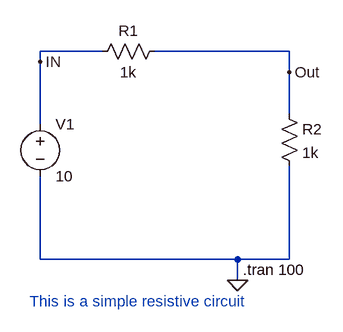
[diagram p0: schematic voltage-divider.asc]
voltage-divider.asc, the LTspice schematic file:
Version 4
SHEET 1 880 680
WIRE 256 240 160 240
WIRE 544 240 336 240
WIRE 160 256 160 240
WIRE 544 272 544 240
WIRE 544 336 544 272
WIRE 160 352 160 256
WIRE 160 560 160 432
WIRE 464 560 160 560
WIRE 544 560 544 416
WIRE 544 560 464 560
WIRE 464 592 464 560
FLAG 464 592 0
FLAG 544 272 Out
FLAG 160 256 IN
SYMBOL res 352 224 R90
WINDOW 0 0 56 VBottom 2
WINDOW 3 32 56 VTop 2
SYMATTR InstName R1
SYMATTR Value 1k
SYMBOL res 528 320 R0
SYMATTR InstName R2
SYMATTR Value 1k
SYMBOL voltage 160 336 R0
SYMATTR InstName V1
SYMATTR Value 10
TEXT 472 576 Left 2 !.tran 100
TEXT 144 624 Left 2 ;This is a simple resistive circuit

The netlist it stands for:
* voltage-divider.asc
R1 Out IN 1k
R2 Out 0 1k
V1 IN 0 10
.tran 100
* This is a simple resistive circuit
.backanno
.end